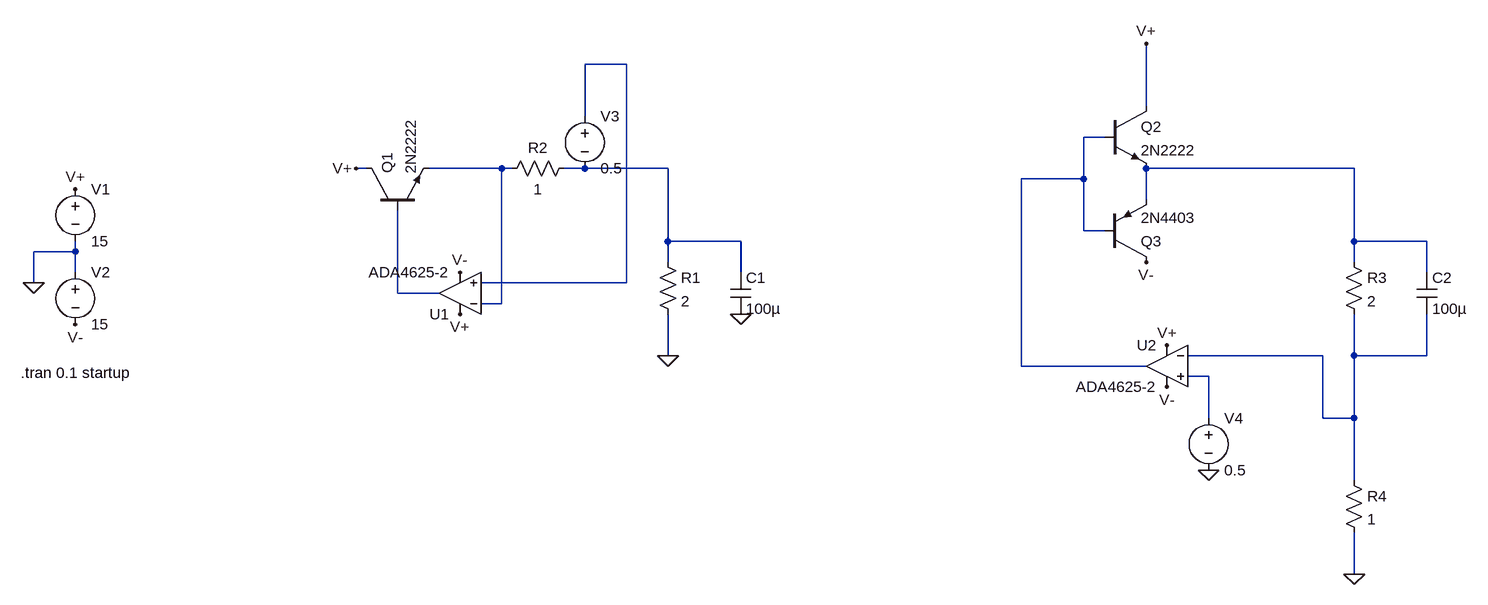
[diagram p0: schematic Draft11.asc]
Draft11.asc, the LTspice schematic file:
Version 4
SHEET 1 2320 680
WIRE 800 -176 736 -176
WIRE 1600 -112 1600 -208
WIRE 736 -96 736 -176
WIRE 1536 -64 1504 -64
WIRE 400 -16 384 -16
WIRE 608 -16 496 -16
WIRE 624 -16 608 -16
WIRE 736 -16 704 -16
WIRE 864 -16 736 -16
WIRE 1920 -16 1600 -16
WIRE 1504 0 1504 -64
WIRE 1504 0 1408 0
WIRE 1600 32 1600 -16
WIRE 1504 80 1504 0
WIRE 1536 80 1504 80
WIRE 864 96 864 -16
WIRE 976 96 864 96
WIRE 1920 96 1920 -16
WIRE 2032 96 1920 96
WIRE -48 112 -48 96
WIRE -48 112 -112 112
WIRE 864 128 864 96
WIRE 1920 128 1920 96
WIRE -48 144 -48 112
WIRE 976 144 976 96
WIRE 2032 144 2032 96
WIRE -112 160 -112 112
WIRE 800 160 800 -176
WIRE 800 160 576 160
WIRE 448 176 448 48
WIRE 512 176 448 176
WIRE 608 192 608 -16
WIRE 608 192 576 192
WIRE 864 272 864 208
WIRE 1872 272 1664 272
WIRE 1920 272 1920 208
WIRE 2032 272 2032 208
WIRE 2032 272 1920 272
WIRE 1408 288 1408 0
WIRE 1600 288 1408 288
WIRE 1696 304 1664 304
WIRE 1696 368 1696 304
WIRE 1872 368 1872 272
WIRE 1920 368 1920 272
WIRE 1920 368 1872 368
WIRE 1920 464 1920 368
WIRE 1920 608 1920 544
FLAG -48 16 V+
FLAG 544 208 V+
FLAG -48 224 V-
FLAG 544 144 V-
FLAG -112 160 0
FLAG 384 -16 V+
FLAG 864 272 0
FLAG 976 208 0
FLAG 1632 256 V+
FLAG 1632 320 V-
FLAG 1600 -208 V+
FLAG 1920 608 0
FLAG 1696 448 0
FLAG 1600 128 V-
SYMBOL Opamps\\ADA4625-2 544 240 R180
SYMATTR InstName U1
SYMBOL voltage -48 0 R0
WINDOW 123 0 0 Left 0
WINDOW 39 0 0 Left 0
SYMATTR InstName V1
SYMATTR Value 15
SYMBOL voltage -48 128 R0
WINDOW 123 0 0 Left 0
WINDOW 39 0 0 Left 0
SYMATTR InstName V2
SYMATTR Value 15
SYMBOL npn 400 48 R270
SYMATTR InstName Q1
SYMATTR Value 2N2222
SYMBOL res 848 112 R0
SYMATTR InstName R1
SYMATTR Value 2
SYMBOL res 720 -32 R90
WINDOW 0 0 56 VBottom 2
WINDOW 3 32 56 VTop 2
SYMATTR InstName R2
SYMATTR Value 1
SYMBOL voltage 736 -112 R0
WINDOW 123 0 0 Left 0
WINDOW 39 0 0 Left 0
SYMATTR InstName V3
SYMATTR Value 0.5
SYMBOL cap 960 144 R0
SYMATTR InstName C1
SYMATTR Value 100µ
SYMBOL Opamps\\ADA4625-2 1632 224 M0
SYMATTR InstName U2
SYMBOL npn 1536 -112 R0
SYMATTR InstName Q2
SYMATTR Value 2N2222
SYMBOL res 1904 112 R0
SYMATTR InstName R3
SYMATTR Value 2
SYMBOL res 1904 448 R0
SYMATTR InstName R4
SYMATTR Value 1
SYMBOL voltage 1696 352 R0
WINDOW 123 0 0 Left 0
WINDOW 39 0 0 Left 0
SYMATTR InstName V4
SYMATTR Value 0.5
SYMBOL cap 2016 144 R0
SYMATTR InstName C2
SYMATTR Value 100µ
SYMBOL pnp 1536 128 M180
SYMATTR InstName Q3
SYMATTR Value 2N4403
TEXT -132 298 Left 2 !.tran 0.1 startup

The netlist it stands for:
* Draft11.asc
XU1 N001 N003 V+ V- N006 ADA4625-2  ; pins In+ In- V+ V- OUT
V1 V+ 0 15
V2 0 V- 15
Q1 V+ N006 N003 0 2N2222
R1 N004 0 2
R2 N004 N003 1
V3 N001 N004 0.5
C1 N004 0 100µ
XU2 N008 N007 V+ V- N002 ADA4625-2  ; pins In+ In- V+ V- OUT
Q2 V+ N002 N005 0 2N2222
R3 N005 N007 2
R4 N007 0 1
V4 N008 0 0.5
C2 N005 N007 100µ
Q3 V- N002 N005 0 2N4403
.model NPN NPN
.model PNP PNP
.lib standard.bjt
.tran 0.1 startup
.backanno
.end